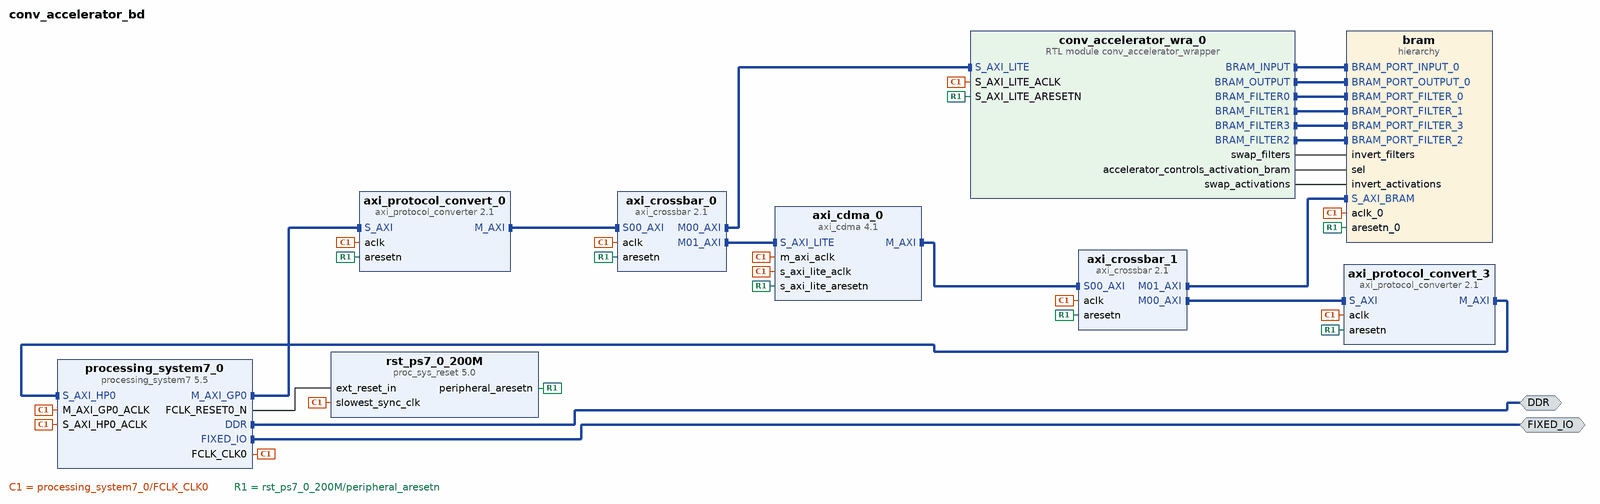
[diagram p0: block diagram of the top level]
# Vivado block design conv_accelerator_bd, xc7z020clg484-1, Vivado 2020.1
create_bd_design conv_accelerator_bd

create_bd_intf_port -mode Master -vlnv xilinx.com:interface:ddrx_rtl:1.0 DDR
create_bd_intf_port -mode Master -vlnv xilinx.com:display_processing_system7:fixedio_rtl:1.0 FIXED_IO

create_bd_cell -type ip -vlnv xilinx.com:ip:axi_cdma:4.1 axi_cdma_0
set_property -dict {CONFIG.C_INCLUDE_DRE 1 CONFIG.C_INCLUDE_SG 0 CONFIG.C_M_AXI_MAX_BURST_LEN 256} [get_bd_cells axi_cdma_0]
create_bd_cell -type ip -vlnv xilinx.com:ip:axi_crossbar:2.1 axi_crossbar_0
set_property -dict {CONFIG.STRATEGY 1} [get_bd_cells axi_crossbar_0]
create_bd_cell -type ip -vlnv xilinx.com:ip:axi_crossbar:2.1 axi_crossbar_1
create_bd_cell -type ip -vlnv xilinx.com:ip:axi_protocol_converter:2.1 axi_protocol_convert_0
set_property -dict [list \
  CONFIG.DATA_WIDTH 32 \
  CONFIG.MI_PROTOCOL AXI4LITE \
  CONFIG.TRANSLATION_MODE 2 \
] [get_bd_cells axi_protocol_convert_0]
create_bd_cell -type ip -vlnv xilinx.com:ip:axi_protocol_converter:2.1 axi_protocol_convert_3
create_bd_cell -type hier bram
create_bd_cell -type ip -vlnv xilinx.com:ip:processing_system7:5.5 processing_system7_0
set_property -dict [list \
  CONFIG.PCW_APU_PERIPHERAL_FREQMHZ 666.666667 \
  CONFIG.PCW_ENET0_ENET0_IO {MIO 16 .. 27} \
  CONFIG.PCW_ENET0_GRP_MDIO_ENABLE 1 \
  CONFIG.PCW_ENET0_GRP_MDIO_IO {MIO 52 .. 53} \
  CONFIG.PCW_ENET0_PERIPHERAL_ENABLE 1 \
  CONFIG.PCW_ENET0_RESET_ENABLE 0 \
  CONFIG.PCW_ENET_RESET_ENABLE 1 \
  CONFIG.PCW_ENET_RESET_SELECT {Share reset pin} \
  CONFIG.PCW_FPGA0_PERIPHERAL_FREQMHZ 85 \
  CONFIG.PCW_FPGA1_PERIPHERAL_FREQMHZ 150.000000 \
  CONFIG.PCW_GPIO_MIO_GPIO_ENABLE 1 \
  CONFIG.PCW_GPIO_MIO_GPIO_IO MIO \
  CONFIG.PCW_I2C_RESET_ENABLE 1 \
  CONFIG.PCW_PERIPHERAL_BOARD_PRESET part0 \
  CONFIG.PCW_PRESET_BANK1_VOLTAGE {LVCMOS 1.8V} \
  CONFIG.PCW_QSPI_GRP_SINGLE_SS_ENABLE 1 \
  CONFIG.PCW_QSPI_GRP_SINGLE_SS_IO {MIO 1 .. 6} \
  CONFIG.PCW_QSPI_PERIPHERAL_ENABLE 1 \
  CONFIG.PCW_QSPI_QSPI_IO {MIO 1 .. 6} \
  CONFIG.PCW_SD0_GRP_CD_ENABLE 1 \
  CONFIG.PCW_SD0_GRP_CD_IO {MIO 47} \
  CONFIG.PCW_SD0_GRP_WP_ENABLE 1 \
  CONFIG.PCW_SD0_GRP_WP_IO {MIO 46} \
  CONFIG.PCW_SD0_PERIPHERAL_ENABLE 1 \
  CONFIG.PCW_SD0_SD0_IO {MIO 40 .. 45} \
  CONFIG.PCW_SDIO_PERIPHERAL_FREQMHZ 50 \
  CONFIG.PCW_SINGLE_QSPI_DATA_MODE x4 \
  CONFIG.PCW_S_AXI_HP0_DATA_WIDTH 32 \
  CONFIG.PCW_UART1_PERIPHERAL_ENABLE 1 \
  CONFIG.PCW_UART1_UART1_IO {MIO 48 .. 49} \
  CONFIG.PCW_UART_PERIPHERAL_FREQMHZ 50 \
  CONFIG.PCW_UIPARAM_DDR_FREQ_MHZ 533.333313 \
  CONFIG.PCW_UIPARAM_DDR_PARTNO {MT41J128M16 HA-15E} \
  CONFIG.PCW_USB0_PERIPHERAL_ENABLE 0 \
  CONFIG.PCW_USB_RESET_ENABLE 1 \
  CONFIG.PCW_USE_S_AXI_HP0 1 \
  CONFIG.preset ZedBoard \
] [get_bd_cells processing_system7_0]
# 502 more settings of processing_system7_0 are not shown: defaults, MIO pin electricals, DDR timing, and values the tool derives
create_bd_cell -type ip -vlnv xilinx.com:ip:proc_sys_reset:5.0 rst_ps7_0_200M
create_bd_cell -type module -reference conv_accelerator_wrapper conv_accelerator_wra_0

# ---- hierarchy /bram ----
current_bd_instance /bram
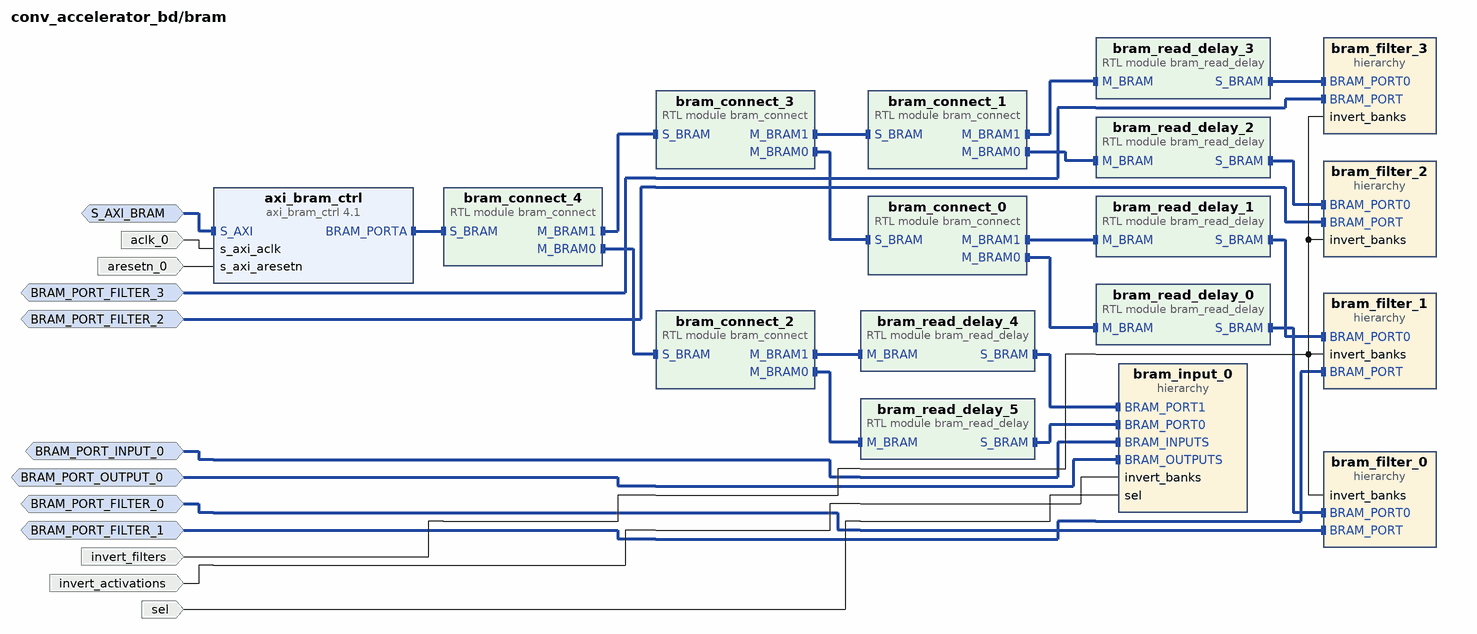
[diagram p1: block diagram inside /bram]
create_bd_intf_pin -mode Slave -vlnv xilinx.com:interface:bram_rtl:1.0 BRAM_PORT_FILTER_0
create_bd_intf_pin -mode Slave -vlnv xilinx.com:interface:bram_rtl:1.0 BRAM_PORT_FILTER_1
create_bd_intf_pin -mode Slave -vlnv xilinx.com:interface:bram_rtl:1.0 BRAM_PORT_FILTER_2
create_bd_intf_pin -mode Slave -vlnv xilinx.com:interface:bram_rtl:1.0 BRAM_PORT_FILTER_3
create_bd_intf_pin -mode Slave -vlnv xilinx.com:interface:bram_rtl:1.0 BRAM_PORT_INPUT_0
create_bd_intf_pin -mode Slave -vlnv xilinx.com:interface:bram_rtl:1.0 BRAM_PORT_OUTPUT_0
create_bd_intf_pin -mode Slave -vlnv xilinx.com:interface:aximm_rtl:1.0 S_AXI_BRAM
create_bd_pin -dir I -type clk aclk_0
create_bd_pin -dir I -type rst aresetn_0
create_bd_pin -dir I invert_activations
create_bd_pin -dir I invert_filters
create_bd_pin -dir I sel

create_bd_cell -type ip -vlnv xilinx.com:ip:axi_bram_ctrl:4.1 axi_bram_ctrl
set_property -dict [list \
  CONFIG.DATA_WIDTH 32 \
  CONFIG.PROTOCOL AXI4 \
  CONFIG.READ_LATENCY 2 \
  CONFIG.SINGLE_PORT_BRAM 1 \
] [get_bd_cells axi_bram_ctrl]
create_bd_cell -type module -reference bram_connect bram_connect_0
set_property -dict {CONFIG.DATA_WIDTH 32 CONFIG.M_ADDR_WIDTH 11} [get_bd_cells bram_connect_0]
create_bd_cell -type module -reference bram_connect bram_connect_1
set_property -dict {CONFIG.DATA_WIDTH 32 CONFIG.M_ADDR_WIDTH 11} [get_bd_cells bram_connect_1]
create_bd_cell -type module -reference bram_connect bram_connect_2
set_property -dict {CONFIG.DATA_WIDTH 32 CONFIG.M_ADDR_WIDTH 17} [get_bd_cells bram_connect_2]
create_bd_cell -type module -reference bram_connect bram_connect_3
set_property -dict {CONFIG.DATA_WIDTH 32 CONFIG.M_ADDR_WIDTH 12} [get_bd_cells bram_connect_3]
create_bd_cell -type module -reference bram_connect bram_connect_4
set_property -dict {CONFIG.DATA_WIDTH 32 CONFIG.M_ADDR_WIDTH 18} [get_bd_cells bram_connect_4]
create_bd_cell -type hier bram_filter_0
create_bd_cell -type hier bram_filter_1
create_bd_cell -type hier bram_filter_2
create_bd_cell -type hier bram_filter_3
create_bd_cell -type hier bram_input_0
create_bd_cell -type module -reference bram_read_delay bram_read_delay_0
create_bd_cell -type module -reference bram_read_delay bram_read_delay_1
create_bd_cell -type module -reference bram_read_delay bram_read_delay_2
create_bd_cell -type module -reference bram_read_delay bram_read_delay_3
create_bd_cell -type module -reference bram_read_delay bram_read_delay_4
create_bd_cell -type module -reference bram_read_delay bram_read_delay_5

# ---- hierarchy /bram/bram_filter_0 ----
current_bd_instance /bram/bram_filter_0
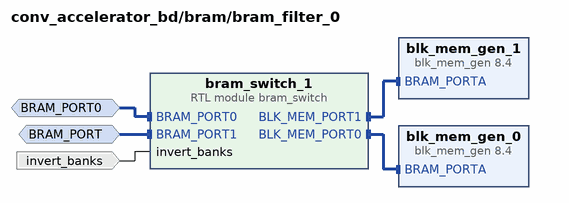
[diagram p2: block diagram inside /bram/bram_filter_0]
create_bd_intf_pin -mode Slave -vlnv xilinx.com:interface:bram_rtl:1.0 BRAM_PORT
create_bd_intf_pin -mode Slave -vlnv xilinx.com:interface:bram_rtl:1.0 BRAM_PORT0
create_bd_pin -dir I invert_banks

create_bd_cell -type ip -vlnv xilinx.com:ip:blk_mem_gen:8.4 blk_mem_gen_0
set_property -dict [list \
  CONFIG.EN_SAFETY_CKT false \
  CONFIG.Enable_32bit_Address true \
  CONFIG.Enable_A Use_ENA_Pin \
  CONFIG.Memory_Type Single_Port_RAM \
  CONFIG.Operating_Mode_A WRITE_FIRST \
  CONFIG.Port_B_Clock 0 \
  CONFIG.Port_B_Enable_Rate 0 \
  CONFIG.Port_B_Write_Rate 0 \
  CONFIG.Read_Width_A 32 \
  CONFIG.Register_PortA_Output_of_Memory_Core false \
  CONFIG.Register_PortA_Output_of_Memory_Primitives false \
  CONFIG.Use_RSTA_Pin true \
  CONFIG.Write_Depth_A 512 \
  CONFIG.Write_Width_A 32 \
  CONFIG.use_bram_block Stand_Alone \
] [get_bd_cells blk_mem_gen_0]
create_bd_cell -type ip -vlnv xilinx.com:ip:blk_mem_gen:8.4 blk_mem_gen_1
set_property -dict [list \
  CONFIG.EN_SAFETY_CKT false \
  CONFIG.Enable_32bit_Address true \
  CONFIG.Enable_A Use_ENA_Pin \
  CONFIG.Memory_Type Single_Port_RAM \
  CONFIG.Operating_Mode_A WRITE_FIRST \
  CONFIG.Port_B_Clock 0 \
  CONFIG.Port_B_Enable_Rate 0 \
  CONFIG.Port_B_Write_Rate 0 \
  CONFIG.Read_Width_A 32 \
  CONFIG.Register_PortA_Output_of_Memory_Core false \
  CONFIG.Register_PortA_Output_of_Memory_Primitives false \
  CONFIG.Use_RSTA_Pin true \
  CONFIG.Write_Depth_A 512 \
  CONFIG.Write_Width_A 32 \
  CONFIG.use_bram_block Stand_Alone \
] [get_bd_cells blk_mem_gen_1]
create_bd_cell -type module -reference bram_switch bram_switch_1
set_property -dict {CONFIG.ADDR_WIDTH 32 CONFIG.DATA_WIDTH 32} [get_bd_cells bram_switch_1]

# ---- hierarchy /bram/bram_filter_1 ----
current_bd_instance /bram/bram_filter_1
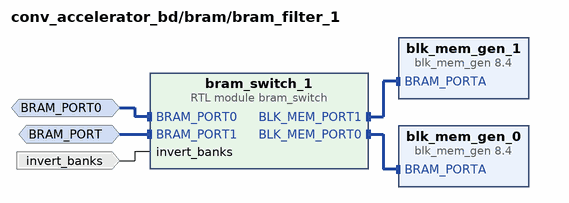
[diagram p3: block diagram inside /bram/bram_filter_1]
create_bd_intf_pin -mode Slave -vlnv xilinx.com:interface:bram_rtl:1.0 BRAM_PORT
create_bd_intf_pin -mode Slave -vlnv xilinx.com:interface:bram_rtl:1.0 BRAM_PORT0
create_bd_pin -dir I invert_banks

create_bd_cell -type ip -vlnv xilinx.com:ip:blk_mem_gen:8.4 blk_mem_gen_0
set_property -dict [list \
  CONFIG.EN_SAFETY_CKT false \
  CONFIG.Enable_32bit_Address true \
  CONFIG.Enable_A Use_ENA_Pin \
  CONFIG.Memory_Type Single_Port_RAM \
  CONFIG.Operating_Mode_A WRITE_FIRST \
  CONFIG.Port_B_Clock 0 \
  CONFIG.Port_B_Enable_Rate 0 \
  CONFIG.Port_B_Write_Rate 0 \
  CONFIG.Read_Width_A 32 \
  CONFIG.Register_PortA_Output_of_Memory_Core false \
  CONFIG.Register_PortA_Output_of_Memory_Primitives false \
  CONFIG.Use_RSTA_Pin true \
  CONFIG.Write_Depth_A 512 \
  CONFIG.Write_Width_A 32 \
  CONFIG.use_bram_block Stand_Alone \
] [get_bd_cells blk_mem_gen_0]
create_bd_cell -type ip -vlnv xilinx.com:ip:blk_mem_gen:8.4 blk_mem_gen_1
set_property -dict [list \
  CONFIG.EN_SAFETY_CKT false \
  CONFIG.Enable_32bit_Address true \
  CONFIG.Enable_A Use_ENA_Pin \
  CONFIG.Memory_Type Single_Port_RAM \
  CONFIG.Operating_Mode_A WRITE_FIRST \
  CONFIG.Port_B_Clock 0 \
  CONFIG.Port_B_Enable_Rate 0 \
  CONFIG.Port_B_Write_Rate 0 \
  CONFIG.Read_Width_A 32 \
  CONFIG.Register_PortA_Output_of_Memory_Core false \
  CONFIG.Register_PortA_Output_of_Memory_Primitives false \
  CONFIG.Use_RSTA_Pin true \
  CONFIG.Write_Depth_A 512 \
  CONFIG.Write_Width_A 32 \
  CONFIG.use_bram_block Stand_Alone \
] [get_bd_cells blk_mem_gen_1]
create_bd_cell -type module -reference bram_switch bram_switch_1
set_property -dict {CONFIG.ADDR_WIDTH 32 CONFIG.DATA_WIDTH 32} [get_bd_cells bram_switch_1]

# ---- hierarchy /bram/bram_filter_2 ----
current_bd_instance /bram/bram_filter_2
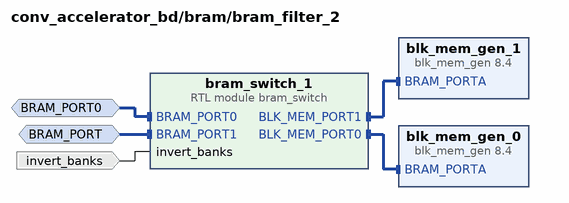
[diagram p4: block diagram inside /bram/bram_filter_2]
create_bd_intf_pin -mode Slave -vlnv xilinx.com:interface:bram_rtl:1.0 BRAM_PORT
create_bd_intf_pin -mode Slave -vlnv xilinx.com:interface:bram_rtl:1.0 BRAM_PORT0
create_bd_pin -dir I invert_banks

create_bd_cell -type ip -vlnv xilinx.com:ip:blk_mem_gen:8.4 blk_mem_gen_0
set_property -dict [list \
  CONFIG.EN_SAFETY_CKT false \
  CONFIG.Enable_32bit_Address true \
  CONFIG.Enable_A Use_ENA_Pin \
  CONFIG.Memory_Type Single_Port_RAM \
  CONFIG.Operating_Mode_A WRITE_FIRST \
  CONFIG.Port_B_Clock 0 \
  CONFIG.Port_B_Enable_Rate 0 \
  CONFIG.Port_B_Write_Rate 0 \
  CONFIG.Read_Width_A 32 \
  CONFIG.Register_PortA_Output_of_Memory_Core false \
  CONFIG.Register_PortA_Output_of_Memory_Primitives false \
  CONFIG.Use_RSTA_Pin true \
  CONFIG.Write_Depth_A 512 \
  CONFIG.Write_Width_A 32 \
  CONFIG.use_bram_block Stand_Alone \
] [get_bd_cells blk_mem_gen_0]
create_bd_cell -type ip -vlnv xilinx.com:ip:blk_mem_gen:8.4 blk_mem_gen_1
set_property -dict [list \
  CONFIG.EN_SAFETY_CKT false \
  CONFIG.Enable_32bit_Address true \
  CONFIG.Enable_A Use_ENA_Pin \
  CONFIG.Memory_Type Single_Port_RAM \
  CONFIG.Operating_Mode_A WRITE_FIRST \
  CONFIG.Port_B_Clock 0 \
  CONFIG.Port_B_Enable_Rate 0 \
  CONFIG.Port_B_Write_Rate 0 \
  CONFIG.Read_Width_A 32 \
  CONFIG.Register_PortA_Output_of_Memory_Core false \
  CONFIG.Register_PortA_Output_of_Memory_Primitives false \
  CONFIG.Use_RSTA_Pin true \
  CONFIG.Write_Depth_A 512 \
  CONFIG.Write_Width_A 32 \
  CONFIG.use_bram_block Stand_Alone \
] [get_bd_cells blk_mem_gen_1]
create_bd_cell -type module -reference bram_switch bram_switch_1
set_property -dict {CONFIG.ADDR_WIDTH 32 CONFIG.DATA_WIDTH 32} [get_bd_cells bram_switch_1]

# ---- hierarchy /bram/bram_filter_3 ----
current_bd_instance /bram/bram_filter_3
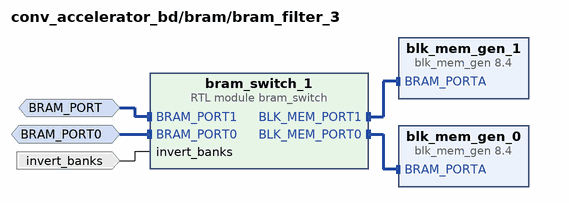
[diagram p5: block diagram inside /bram/bram_filter_3]
create_bd_intf_pin -mode Slave -vlnv xilinx.com:interface:bram_rtl:1.0 BRAM_PORT
create_bd_intf_pin -mode Slave -vlnv xilinx.com:interface:bram_rtl:1.0 BRAM_PORT0
create_bd_pin -dir I invert_banks

create_bd_cell -type ip -vlnv xilinx.com:ip:blk_mem_gen:8.4 blk_mem_gen_0
set_property -dict [list \
  CONFIG.EN_SAFETY_CKT false \
  CONFIG.Enable_32bit_Address true \
  CONFIG.Enable_A Use_ENA_Pin \
  CONFIG.Memory_Type Single_Port_RAM \
  CONFIG.Operating_Mode_A WRITE_FIRST \
  CONFIG.Port_B_Clock 0 \
  CONFIG.Port_B_Enable_Rate 0 \
  CONFIG.Port_B_Write_Rate 0 \
  CONFIG.Read_Width_A 32 \
  CONFIG.Register_PortA_Output_of_Memory_Core false \
  CONFIG.Register_PortA_Output_of_Memory_Primitives false \
  CONFIG.Use_RSTA_Pin true \
  CONFIG.Write_Depth_A 512 \
  CONFIG.Write_Width_A 32 \
  CONFIG.use_bram_block Stand_Alone \
] [get_bd_cells blk_mem_gen_0]
create_bd_cell -type ip -vlnv xilinx.com:ip:blk_mem_gen:8.4 blk_mem_gen_1
set_property -dict [list \
  CONFIG.EN_SAFETY_CKT false \
  CONFIG.Enable_32bit_Address true \
  CONFIG.Enable_A Use_ENA_Pin \
  CONFIG.Memory_Type Single_Port_RAM \
  CONFIG.Operating_Mode_A WRITE_FIRST \
  CONFIG.Port_B_Clock 0 \
  CONFIG.Port_B_Enable_Rate 0 \
  CONFIG.Port_B_Write_Rate 0 \
  CONFIG.Read_Width_A 32 \
  CONFIG.Register_PortA_Output_of_Memory_Core false \
  CONFIG.Register_PortA_Output_of_Memory_Primitives false \
  CONFIG.Use_RSTA_Pin true \
  CONFIG.Write_Depth_A 512 \
  CONFIG.Write_Width_A 32 \
  CONFIG.use_bram_block Stand_Alone \
] [get_bd_cells blk_mem_gen_1]
create_bd_cell -type module -reference bram_switch bram_switch_1
set_property -dict {CONFIG.ADDR_WIDTH 32 CONFIG.DATA_WIDTH 32} [get_bd_cells bram_switch_1]

# ---- hierarchy /bram/bram_input_0 ----
current_bd_instance /bram/bram_input_0
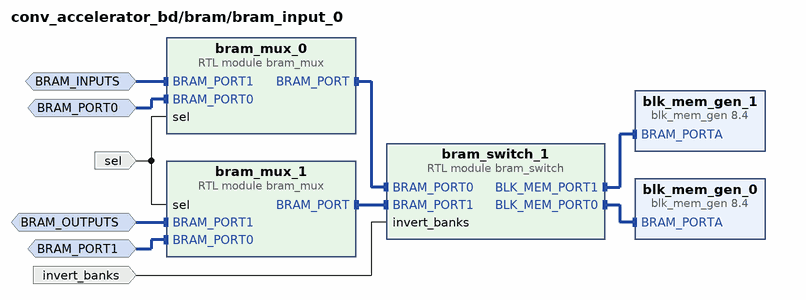
[diagram p6: block diagram inside /bram/bram_input_0]
create_bd_intf_pin -mode Slave -vlnv xilinx.com:interface:bram_rtl:1.0 BRAM_INPUTS
create_bd_intf_pin -mode Slave -vlnv xilinx.com:interface:bram_rtl:1.0 BRAM_OUTPUTS
create_bd_intf_pin -mode Slave -vlnv xilinx.com:interface:bram_rtl:1.0 BRAM_PORT0
create_bd_intf_pin -mode Slave -vlnv xilinx.com:interface:bram_rtl:1.0 BRAM_PORT1
create_bd_pin -dir I invert_banks
create_bd_pin -dir I sel

create_bd_cell -type ip -vlnv xilinx.com:ip:blk_mem_gen:8.4 blk_mem_gen_0
set_property -dict [list \
  CONFIG.EN_SAFETY_CKT false \
  CONFIG.Enable_32bit_Address true \
  CONFIG.Enable_A Use_ENA_Pin \
  CONFIG.Memory_Type Single_Port_RAM \
  CONFIG.Operating_Mode_A WRITE_FIRST \
  CONFIG.Port_B_Clock 0 \
  CONFIG.Port_B_Enable_Rate 0 \
  CONFIG.Port_B_Write_Rate 0 \
  CONFIG.Read_Width_A 32 \
  CONFIG.Register_PortA_Output_of_Memory_Core false \
  CONFIG.Register_PortA_Output_of_Memory_Primitives false \
  CONFIG.Use_RSTA_Pin true \
  CONFIG.Write_Depth_A 32768 \
  CONFIG.Write_Width_A 32 \
  CONFIG.use_bram_block Stand_Alone \
] [get_bd_cells blk_mem_gen_0]
create_bd_cell -type ip -vlnv xilinx.com:ip:blk_mem_gen:8.4 blk_mem_gen_1
set_property -dict [list \
  CONFIG.EN_SAFETY_CKT false \
  CONFIG.Enable_32bit_Address true \
  CONFIG.Enable_A Use_ENA_Pin \
  CONFIG.Memory_Type Single_Port_RAM \
  CONFIG.Operating_Mode_A WRITE_FIRST \
  CONFIG.Port_B_Clock 0 \
  CONFIG.Port_B_Enable_Rate 0 \
  CONFIG.Port_B_Write_Rate 0 \
  CONFIG.Read_Width_A 32 \
  CONFIG.Register_PortA_Output_of_Memory_Core false \
  CONFIG.Register_PortA_Output_of_Memory_Primitives false \
  CONFIG.Use_RSTA_Pin true \
  CONFIG.Write_Depth_A 32768 \
  CONFIG.Write_Width_A 32 \
  CONFIG.use_bram_block Stand_Alone \
] [get_bd_cells blk_mem_gen_1]
create_bd_cell -type module -reference bram_mux bram_mux_0
set_property -dict {CONFIG.ADDR_DEPTH 32 CONFIG.DATA_WIDTH 32} [get_bd_cells bram_mux_0]
create_bd_cell -type module -reference bram_mux bram_mux_1
set_property -dict {CONFIG.ADDR_DEPTH 32 CONFIG.DATA_WIDTH 32} [get_bd_cells bram_mux_1]
create_bd_cell -type module -reference bram_switch bram_switch_1
set_property -dict {CONFIG.ADDR_WIDTH 32 CONFIG.DATA_WIDTH 32} [get_bd_cells bram_switch_1]

# ---- connections ----

current_bd_instance /bram
connect_bd_intf_net [get_bd_intf_pins bram_connect_0/M_BRAM0] [get_bd_intf_pins bram_read_delay_0/M_BRAM]
connect_bd_intf_net [get_bd_intf_pins bram_connect_0/S_BRAM] [get_bd_intf_pins bram_connect_3/M_BRAM0]
connect_bd_intf_net [get_bd_intf_pins BRAM_PORT_INPUT_0] [get_bd_intf_pins bram_input_0/BRAM_INPUTS]
connect_bd_intf_net [get_bd_intf_pins bram_connect_0/M_BRAM1] [get_bd_intf_pins bram_read_delay_1/M_BRAM]
connect_bd_intf_net [get_bd_intf_pins BRAM_PORT_FILTER_3] [get_bd_intf_pins bram_filter_3/BRAM_PORT]
connect_bd_intf_net [get_bd_intf_pins bram_connect_1/M_BRAM0] [get_bd_intf_pins bram_read_delay_2/M_BRAM]
connect_bd_intf_net [get_bd_intf_pins bram_connect_2/S_BRAM] [get_bd_intf_pins bram_connect_4/M_BRAM0]
connect_bd_intf_net [get_bd_intf_pins bram_filter_3/BRAM_PORT0] [get_bd_intf_pins bram_read_delay_3/S_BRAM]
connect_bd_intf_net [get_bd_intf_pins bram_filter_0/BRAM_PORT0] [get_bd_intf_pins bram_read_delay_0/S_BRAM]
connect_bd_intf_net [get_bd_intf_pins bram_input_0/BRAM_PORT1] [get_bd_intf_pins bram_read_delay_4/S_BRAM]
connect_bd_intf_net [get_bd_intf_pins BRAM_PORT_OUTPUT_0] [get_bd_intf_pins bram_input_0/BRAM_OUTPUTS]
connect_bd_intf_net [get_bd_intf_pins BRAM_PORT_FILTER_0] [get_bd_intf_pins bram_filter_0/BRAM_PORT]
connect_bd_intf_net [get_bd_intf_pins bram_connect_3/S_BRAM] [get_bd_intf_pins bram_connect_4/M_BRAM1]
connect_bd_intf_net [get_bd_intf_pins bram_input_0/BRAM_PORT0] [get_bd_intf_pins bram_read_delay_5/S_BRAM]
connect_bd_intf_net [get_bd_intf_pins bram_connect_1/M_BRAM1] [get_bd_intf_pins bram_read_delay_3/M_BRAM]
connect_bd_intf_net [get_bd_intf_pins BRAM_PORT_FILTER_2] [get_bd_intf_pins bram_filter_2/BRAM_PORT]
connect_bd_intf_net [get_bd_intf_pins bram_filter_1/BRAM_PORT0] [get_bd_intf_pins bram_read_delay_1/S_BRAM]
connect_bd_intf_net [get_bd_intf_pins S_AXI_BRAM] [get_bd_intf_pins axi_bram_ctrl/S_AXI]
connect_bd_intf_net [get_bd_intf_pins bram_connect_1/S_BRAM] [get_bd_intf_pins bram_connect_3/M_BRAM1]
connect_bd_intf_net [get_bd_intf_pins bram_filter_2/BRAM_PORT0] [get_bd_intf_pins bram_read_delay_2/S_BRAM]
connect_bd_intf_net [get_bd_intf_pins axi_bram_ctrl/BRAM_PORTA] [get_bd_intf_pins bram_connect_4/S_BRAM]
connect_bd_intf_net [get_bd_intf_pins BRAM_PORT_FILTER_1] [get_bd_intf_pins bram_filter_1/BRAM_PORT]
connect_bd_intf_net [get_bd_intf_pins bram_connect_2/M_BRAM1] [get_bd_intf_pins bram_read_delay_4/M_BRAM]
connect_bd_intf_net [get_bd_intf_pins bram_connect_2/M_BRAM0] [get_bd_intf_pins bram_read_delay_5/M_BRAM]
connect_bd_net -net aclk_0_1 [get_bd_pins aclk_0] [get_bd_pins axi_bram_ctrl/s_axi_aclk]
connect_bd_net -net aresetn_0_1 [get_bd_pins aresetn_0] [get_bd_pins axi_bram_ctrl/s_axi_aresetn]
connect_bd_net -net invert_banks_1 [get_bd_pins invert_filters] \
  [get_bd_pins bram_filter_0/invert_banks] [get_bd_pins bram_filter_1/invert_banks] [get_bd_pins bram_filter_2/invert_banks] \
  [get_bd_pins bram_filter_3/invert_banks]
connect_bd_net -net invert_banks_2 [get_bd_pins invert_activations] [get_bd_pins bram_input_0/invert_banks]
connect_bd_net [get_bd_pins sel] [get_bd_pins bram_input_0/sel]

current_bd_instance /bram/bram_filter_0
connect_bd_intf_net [get_bd_intf_pins blk_mem_gen_1/BRAM_PORTA] [get_bd_intf_pins bram_switch_1/BLK_MEM_PORT1]
connect_bd_intf_net [get_bd_intf_pins blk_mem_gen_0/BRAM_PORTA] [get_bd_intf_pins bram_switch_1/BLK_MEM_PORT0]
connect_bd_intf_net [get_bd_intf_pins BRAM_PORT0] [get_bd_intf_pins bram_switch_1/BRAM_PORT0]
connect_bd_intf_net [get_bd_intf_pins BRAM_PORT] [get_bd_intf_pins bram_switch_1/BRAM_PORT1]
connect_bd_net -net invert_banks_0_2 [get_bd_pins invert_banks] [get_bd_pins bram_switch_1/invert_banks]

current_bd_instance /bram/bram_filter_1
connect_bd_intf_net [get_bd_intf_pins BRAM_PORT0] [get_bd_intf_pins bram_switch_1/BRAM_PORT0]
connect_bd_intf_net [get_bd_intf_pins blk_mem_gen_1/BRAM_PORTA] [get_bd_intf_pins bram_switch_1/BLK_MEM_PORT1]
connect_bd_intf_net [get_bd_intf_pins BRAM_PORT] [get_bd_intf_pins bram_switch_1/BRAM_PORT1]
connect_bd_intf_net [get_bd_intf_pins blk_mem_gen_0/BRAM_PORTA] [get_bd_intf_pins bram_switch_1/BLK_MEM_PORT0]
connect_bd_net -net invert_banks_0_2 [get_bd_pins invert_banks] [get_bd_pins bram_switch_1/invert_banks]

current_bd_instance /bram/bram_filter_2
connect_bd_intf_net [get_bd_intf_pins blk_mem_gen_0/BRAM_PORTA] [get_bd_intf_pins bram_switch_1/BLK_MEM_PORT0]
connect_bd_intf_net [get_bd_intf_pins blk_mem_gen_1/BRAM_PORTA] [get_bd_intf_pins bram_switch_1/BLK_MEM_PORT1]
connect_bd_intf_net [get_bd_intf_pins BRAM_PORT0] [get_bd_intf_pins bram_switch_1/BRAM_PORT0]
connect_bd_intf_net [get_bd_intf_pins BRAM_PORT] [get_bd_intf_pins bram_switch_1/BRAM_PORT1]
connect_bd_net -net invert_banks_0_2 [get_bd_pins invert_banks] [get_bd_pins bram_switch_1/invert_banks]

current_bd_instance /bram/bram_filter_3
connect_bd_intf_net [get_bd_intf_pins blk_mem_gen_1/BRAM_PORTA] [get_bd_intf_pins bram_switch_1/BLK_MEM_PORT1]
connect_bd_intf_net [get_bd_intf_pins BRAM_PORT] [get_bd_intf_pins bram_switch_1/BRAM_PORT1]
connect_bd_intf_net [get_bd_intf_pins BRAM_PORT0] [get_bd_intf_pins bram_switch_1/BRAM_PORT0]
connect_bd_intf_net [get_bd_intf_pins blk_mem_gen_0/BRAM_PORTA] [get_bd_intf_pins bram_switch_1/BLK_MEM_PORT0]
connect_bd_net -net invert_banks_0_2 [get_bd_pins invert_banks] [get_bd_pins bram_switch_1/invert_banks]

current_bd_instance /bram/bram_input_0
connect_bd_intf_net [get_bd_intf_pins bram_mux_0/BRAM_PORT] [get_bd_intf_pins bram_switch_1/BRAM_PORT0]
connect_bd_intf_net [get_bd_intf_pins BRAM_INPUTS] [get_bd_intf_pins bram_mux_0/BRAM_PORT1]
connect_bd_intf_net [get_bd_intf_pins BRAM_PORT0] [get_bd_intf_pins bram_mux_0/BRAM_PORT0]
connect_bd_intf_net [get_bd_intf_pins blk_mem_gen_0/BRAM_PORTA] [get_bd_intf_pins bram_switch_1/BLK_MEM_PORT0]
connect_bd_intf_net [get_bd_intf_pins bram_mux_1/BRAM_PORT] [get_bd_intf_pins bram_switch_1/BRAM_PORT1]
connect_bd_intf_net [get_bd_intf_pins BRAM_OUTPUTS] [get_bd_intf_pins bram_mux_1/BRAM_PORT1]
connect_bd_intf_net [get_bd_intf_pins blk_mem_gen_1/BRAM_PORTA] [get_bd_intf_pins bram_switch_1/BLK_MEM_PORT1]
connect_bd_intf_net [get_bd_intf_pins BRAM_PORT1] [get_bd_intf_pins bram_mux_1/BRAM_PORT0]
connect_bd_net [get_bd_pins sel] [get_bd_pins bram_mux_0/sel] [get_bd_pins bram_mux_1/sel]
connect_bd_net -net invert_banks_0_2 [get_bd_pins invert_banks] [get_bd_pins bram_switch_1/invert_banks]

current_bd_instance /
connect_bd_intf_net [get_bd_intf_pins axi_cdma_0/S_AXI_LITE] [get_bd_intf_pins axi_crossbar_0/M01_AXI]
connect_bd_intf_net [get_bd_intf_pins bram/BRAM_PORT_INPUT_0] [get_bd_intf_pins conv_accelerator_wra_0/BRAM_INPUT]
connect_bd_intf_net [get_bd_intf_pins axi_cdma_0/M_AXI] [get_bd_intf_pins axi_crossbar_1/S00_AXI]
connect_bd_intf_net [get_bd_intf_pins axi_crossbar_1/M01_AXI] [get_bd_intf_pins bram/S_AXI_BRAM]
connect_bd_intf_net [get_bd_intf_pins axi_protocol_convert_3/M_AXI] [get_bd_intf_pins processing_system7_0/S_AXI_HP0]
connect_bd_intf_net [get_bd_intf_pins bram/BRAM_PORT_OUTPUT_0] [get_bd_intf_pins conv_accelerator_wra_0/BRAM_OUTPUT]
connect_bd_intf_net [get_bd_intf_pins axi_crossbar_1/M00_AXI] [get_bd_intf_pins axi_protocol_convert_3/S_AXI]
connect_bd_intf_net [get_bd_intf_ports DDR] [get_bd_intf_pins processing_system7_0/DDR]
connect_bd_intf_net [get_bd_intf_ports FIXED_IO] [get_bd_intf_pins processing_system7_0/FIXED_IO]
connect_bd_intf_net [get_bd_intf_pins bram/BRAM_PORT_FILTER_0] [get_bd_intf_pins conv_accelerator_wra_0/BRAM_FILTER0]
connect_bd_intf_net [get_bd_intf_pins axi_protocol_convert_0/S_AXI] [get_bd_intf_pins processing_system7_0/M_AXI_GP0]
connect_bd_intf_net [get_bd_intf_pins bram/BRAM_PORT_FILTER_1] [get_bd_intf_pins conv_accelerator_wra_0/BRAM_FILTER1]
connect_bd_intf_net [get_bd_intf_pins bram/BRAM_PORT_FILTER_3] [get_bd_intf_pins conv_accelerator_wra_0/BRAM_FILTER3]
connect_bd_intf_net [get_bd_intf_pins bram/BRAM_PORT_FILTER_2] [get_bd_intf_pins conv_accelerator_wra_0/BRAM_FILTER2]
connect_bd_intf_net [get_bd_intf_pins axi_crossbar_0/S00_AXI] [get_bd_intf_pins axi_protocol_convert_0/M_AXI]
connect_bd_intf_net [get_bd_intf_pins axi_crossbar_0/M00_AXI] [get_bd_intf_pins conv_accelerator_wra_0/S_AXI_LITE]
connect_bd_net -net conv_accelerator_0_swap_banks [get_bd_pins conv_accelerator_wra_0/swap_filters] [get_bd_pins bram/invert_filters]
connect_bd_net -net conv_accelerator_wra_0_ps_controls_activation_bram [get_bd_pins conv_accelerator_wra_0/accelerator_controls_activation_bram] \
  [get_bd_pins bram/sel]
connect_bd_net [get_bd_pins conv_accelerator_wra_0/swap_activations] [get_bd_pins bram/invert_activations]
connect_bd_net [get_bd_pins processing_system7_0/FCLK_CLK0] \
  [get_bd_pins axi_cdma_0/m_axi_aclk] [get_bd_pins axi_cdma_0/s_axi_lite_aclk] [get_bd_pins axi_crossbar_0/aclk] \
  [get_bd_pins axi_crossbar_1/aclk] [get_bd_pins axi_protocol_convert_0/aclk] [get_bd_pins axi_protocol_convert_3/aclk] \
  [get_bd_pins bram/aclk_0] [get_bd_pins processing_system7_0/M_AXI_GP0_ACLK] \
  [get_bd_pins processing_system7_0/S_AXI_HP0_ACLK] [get_bd_pins rst_ps7_0_200M/slowest_sync_clk] \
  [get_bd_pins conv_accelerator_wra_0/S_AXI_LITE_ACLK]
connect_bd_net [get_bd_pins processing_system7_0/FCLK_RESET0_N] [get_bd_pins rst_ps7_0_200M/ext_reset_in]
connect_bd_net -net rst_ps7_0_100M_peripheral_aresetn [get_bd_pins rst_ps7_0_200M/peripheral_aresetn] \
  [get_bd_pins axi_cdma_0/s_axi_lite_aresetn] [get_bd_pins axi_crossbar_0/aresetn] [get_bd_pins axi_crossbar_1/aresetn] \
  [get_bd_pins axi_protocol_convert_0/aresetn] [get_bd_pins axi_protocol_convert_3/aresetn] [get_bd_pins bram/aresetn_0] \
  [get_bd_pins conv_accelerator_wra_0/S_AXI_LITE_ARESETN]

# ---- address map ----
assign_bd_address -offset 0x00000000 -range 512M -target_address_space [get_bd_addr_spaces axi_cdma_0/Data] [get_bd_addr_segs processing_system7_0/S_AXI_HP0/HP0_DDR_LOWOCM]
assign_bd_address -offset 0x40000000 -range 512K -target_address_space [get_bd_addr_spaces axi_cdma_0/Data] [get_bd_addr_segs bram/axi_bram_ctrl/S_AXI/Mem0]
assign_bd_address -offset 0x4C000000 -range 64K -target_address_space [get_bd_addr_spaces processing_system7_0/Data] [get_bd_addr_segs conv_accelerator_wra_0/S_AXI_LITE/reg0]
assign_bd_address -offset 0x7E200000 -range 64K -target_address_space [get_bd_addr_spaces processing_system7_0/Data] [get_bd_addr_segs axi_cdma_0/S_AXI_LITE/Reg]

validate_bd_design
save_bd_design
